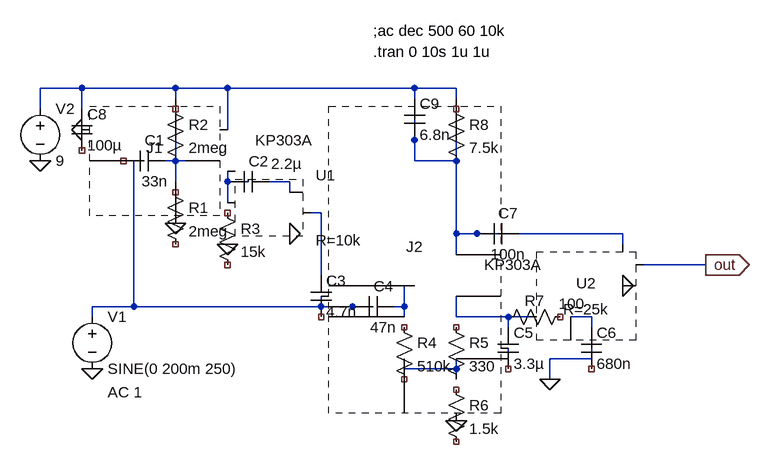
[diagram p0: schematic sage.asc]
sage.asc, the LTspice schematic file:
Version 4
SHEET 1 1136 680
WIRE 80 32 16 32
WIRE 224 32 80 32
WIRE 304 32 224 32
WIRE 592 32 304 32
WIRE 656 32 592 32
WIRE 224 48 224 32
WIRE 592 48 592 32
WIRE 656 48 656 32
WIRE 16 64 16 32
WIRE 80 64 80 32
WIRE 304 96 304 32
WIRE 176 144 160 144
WIRE 224 144 224 112
WIRE 224 144 208 144
WIRE 240 144 224 144
WIRE 592 144 592 80
WIRE 656 144 656 112
WIRE 656 144 592 144
WIRE 224 176 224 144
WIRE 304 176 304 160
WIRE 336 176 304 176
WIRE 400 176 368 176
WIRE 400 192 400 176
WIRE 304 208 304 176
WIRE 448 224 432 224
WIRE 656 256 656 144
WIRE 720 256 656 256
WIRE 912 256 752 256
WIRE 912 272 912 256
WIRE 656 288 656 256
WIRE 1040 304 944 304
WIRE 448 320 448 224
WIRE 592 336 576 336
WIRE 160 368 160 144
WIRE 160 368 96 368
WIRE 448 368 448 352
WIRE 448 368 160 368
WIRE 528 368 448 368
WIRE 576 368 576 336
WIRE 576 368 560 368
WIRE 96 384 96 368
WIRE 576 384 576 368
WIRE 656 384 656 352
WIRE 736 384 656 384
WIRE 768 384 736 384
WIRE 864 384 832 384
WIRE 736 400 736 384
WIRE 864 400 864 384
WIRE 736 448 736 432
WIRE 864 448 864 432
WIRE 864 448 800 448
WIRE 576 464 576 448
WIRE 656 464 656 448
WIRE 656 464 576 464
WIRE 656 480 656 464
WIRE 800 480 800 448
FLAG 16 144 0
FLAG 400 256 0
FLAG 224 240 0
FLAG 96 464 0
FLAG 656 544 0
FLAG 800 480 0
FLAG 912 336 0
FLAG 1040 304 out
IOPIN 1040 304 Out
FLAG 80 96 0
FLAG 304 272 0
SYMBOL voltage 96 368 R0
WINDOW 123 24 132 Left 0
WINDOW 39 0 0 Left 0
SYMATTR InstName V1
SYMATTR Value SINE(0 200m 250)
SYMATTR Value2 AC 1
SYMBOL voltage 16 48 R0
WINDOW 123 0 0 Left 0
WINDOW 39 0 0 Left 0
SYMATTR InstName V2
SYMATTR Value 9
SYMBOL cap 208 128 R90
WINDOW 0 0 16 VBottom 0
WINDOW 3 32 16 VTop 0
SYMATTR InstName C1
SYMATTR Value 33n
SYMBOL res 208 176 R0
SYMATTR InstName R1
SYMATTR Value 2meg
SYMBOL FET\\njf2 240 96 R0
WINDOW 3 107 16 Left 0
SYMATTR InstName J1
SYMATTR Value KP303A
SYMBOL pot 384 192 R0
SYMATTR InstName U1
SYMATTR Value R=10k
SYMATTR Value2 W=0.95
SYMBOL cap 368 160 R90
WINDOW 0 0 16 VBottom 0
WINDOW 3 -27 -27 VTop 0
SYMATTR InstName C2
SYMATTR Value 2.2µ
SYMBOL res 208 48 R0
SYMATTR InstName R2
SYMATTR Value 2meg
SYMBOL res 288 208 R0
SYMATTR InstName R3
SYMATTR Value 15k
SYMBOL cap 432 320 R0
SYMATTR InstName C3
SYMATTR Value 4.7n
SYMBOL cap 560 352 R90
WINDOW 0 0 16 VBottom 0
WINDOW 3 32 16 VTop 0
SYMATTR InstName C4
SYMATTR Value 47n
SYMBOL res 560 384 R0
SYMATTR InstName R4
SYMATTR Value 510k
SYMBOL res 640 384 R0
SYMATTR InstName R5
SYMATTR Value 330
SYMBOL res 640 480 R0
SYMATTR InstName R6
SYMATTR Value 1.5k
SYMBOL FET\\njf2 592 288 R0
WINDOW 3 107 16 Left 0
SYMATTR InstName J2
SYMATTR Value KP303A
SYMBOL cap 720 400 R0
SYMATTR InstName C5
SYMATTR Value 3.3µ
SYMBOL res 832 368 R90
WINDOW 0 7 55 VBottom 0
WINDOW 3 -20 -2 VTop 0
SYMATTR InstName R7
SYMATTR Value 100
SYMBOL cap 848 400 R0
SYMATTR InstName C6
SYMATTR Value 680n
SYMBOL cap 752 240 R90
WINDOW 0 0 16 VBottom 0
WINDOW 3 32 16 VTop 0
SYMATTR InstName C7
SYMATTR Value 100n
SYMBOL pot 896 272 R0
SYMATTR InstName U2
SYMATTR Value R=25k
SYMATTR Value2 W=0.95
SYMBOL cap 64 64 R0
SYMATTR InstName C8
SYMATTR Value 100µ
SYMBOL res 640 48 R0
SYMATTR InstName R8
SYMATTR Value 7.5k
SYMBOL cap 576 48 R0
SYMATTR InstName C9
SYMATTR Value 6.8n
TEXT 528 -24 Left 0 !.tran 0 10s 1u 1u
TEXT 528 -56 Left 0 !;ac dec 500 60 10k

The netlist it stands for:
* sage.asc
V1 N002 0 SINE(0 200m 250) AC 1
V2 N001 0 9
C1 N003 NC_01 33n
R1 NC_02 NC_03 2meg
* J1: KP303A (symbol FET\njf2 not available, pin order unknown); nets seen at it: 0, N001, N002, N003
* U1: R=10k W=0.95 (symbol pot not available, pin order unknown); nets seen at it: 0, N005, N006, N007
C2 N006 N005 2.2µ
R2 NC_04 N003 2meg
R3 NC_05 NC_06 15k
C3 N007 NC_07 4.7n
C4 N009 N002 47n
R4 NC_08 NC_09 510k
R5 NC_10 N013 330
R6 NC_11 NC_12 1.5k
* J2: KP303A (symbol FET\njf2 not available, pin order unknown); nets seen at it: 0, N001, N002, N004, N009, N010, N012, N013
C5 N010 NC_13 3.3µ
R7 NC_14 N010 100
C6 N011 NC_15 680n
C7 N008 N004 100n
* U2: R=25k W=0.95 (symbol pot not available, pin order unknown); nets seen at it: 0, N008, N010, N011, out
C8 N001 NC_16 100µ
R8 NC_17 N004 7.5k
C9 N001 N004 6.8n
.tran 0 10s 1u 1u
;ac dec 500 60 10k
.backanno
.end